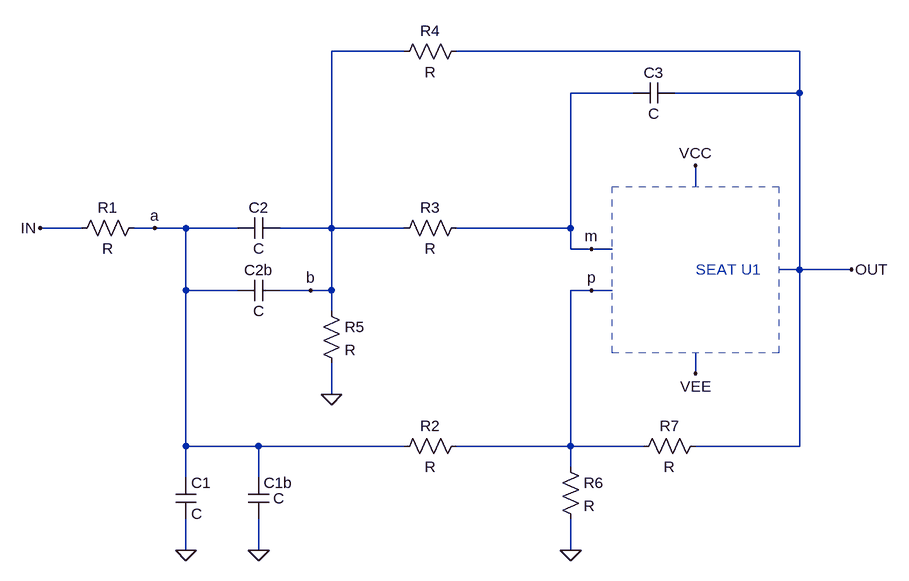
[diagram p0: schematic MFB_LPn_LS.asc]
MFB_LPn_LS.asc, the LTspice schematic file:
Version 4.1
SHEET 1 2076 708
WIRE -144 -80 -256 -80
WIRE 464 -80 -64 -80
WIRE 208 -16 112 -16
WIRE 464 -16 464 -80
WIRE 464 -16 272 -16
WIRE 304 128 304 96
WIRE -640 192 -704 192
WIRE -528 192 -560 192
WIRE -480 192 -528 192
WIRE -400 192 -480 192
WIRE -256 192 -256 -80
WIRE -256 192 -336 192
WIRE -144 192 -256 192
WIRE 112 192 112 -16
WIRE 112 192 -64 192
WIRE 112 224 112 192
WIRE 144 224 112 224
WIRE 176 224 144 224
WIRE 464 256 464 -16
WIRE 464 256 432 256
WIRE 544 256 464 256
WIRE -480 288 -480 192
WIRE -400 288 -480 288
WIRE -288 288 -336 288
WIRE -256 288 -256 192
WIRE -256 288 -288 288
WIRE 144 288 112 288
WIRE 176 288 144 288
WIRE -256 320 -256 288
WIRE 304 416 304 384
WIRE -256 448 -256 400
WIRE -480 528 -480 288
WIRE -368 528 -480 528
WIRE -144 528 -368 528
WIRE 112 528 112 288
WIRE 112 528 -64 528
WIRE 224 528 112 528
WIRE 464 528 464 256
WIRE 464 528 304 528
WIRE 112 560 112 528
WIRE -480 576 -480 528
WIRE -368 576 -368 528
WIRE -480 688 -480 640
WIRE -368 688 -368 640
WIRE 112 688 112 640
FLAG 544 256 OUT
FLAG 304 96 VCC
FLAG 304 416 VEE
FLAG 144 224 m
FLAG 144 288 p
FLAG -528 192 a
FLAG -704 192 IN
FLAG -288 288 b
FLAG 112 688 0
FLAG -480 688 0
FLAG -368 688 0
FLAG -256 448 0
SYMBOL res -544 176 R90
WINDOW 0 0 56 VBottom 2
WINDOW 3 32 56 VTop 2
SYMATTR InstName R1
SYMBOL res -48 512 R90
WINDOW 0 0 56 VBottom 2
WINDOW 3 32 56 VTop 2
SYMATTR InstName R2
SYMBOL res -272 304 R0
SYMATTR InstName R5
SYMBOL res 96 544 R0
SYMATTR InstName R6
SYMBOL res 320 512 R90
WINDOW 0 0 56 VBottom 2
WINDOW 3 32 56 VTop 2
SYMATTR InstName R7
SYMBOL cap -496 576 R0
SYMATTR InstName C1
SYMBOL cap -336 176 R90
WINDOW 0 0 32 VBottom 2
WINDOW 3 32 32 VTop 2
SYMATTR InstName C2
SYMBOL cap 272 -32 R90
WINDOW 0 0 32 VBottom 2
WINDOW 3 32 32 VTop 2
SYMATTR InstName C3
SYMBOL cap -384 576 R0
WINDOW 3 38 32 Left 2
SYMATTR InstName C1b
SYMBOL cap -336 272 R90
WINDOW 0 0 32 VBottom 2
WINDOW 3 32 32 VTop 2
SYMATTR InstName C2b
SYMBOL res -48 -96 R90
WINDOW 0 0 56 VBottom 2
WINDOW 3 32 56 VTop 2
SYMATTR InstName R4
SYMBOL res -48 176 R90
WINDOW 0 0 56 VBottom 2
WINDOW 3 32 56 VTop 2
SYMATTR InstName R3
TEXT 304 256 Left 2 ;SEAT U1
RECTANGLE Normal 176 128 432 384 2

The netlist it stands for:
* MFB_LPn_LS.asc
R1 a IN R
R2 p a R
R5 b 0 R
R6 p 0 R
R7 OUT p R
C1 a 0 C
C2 b a C
C3 OUT m C
C1b a 0 C
C2b b a C
R4 OUT b R
R3 m b R
* SEAT U1
.backanno
.end